# Altium schematic sheet ADC.SchDoc: EEG Measurement Circuit
size A2; Date: 24/01/2025; DrawnBy: Giang Phan Truong; SheetNumber: 5; SheetTotal: 7
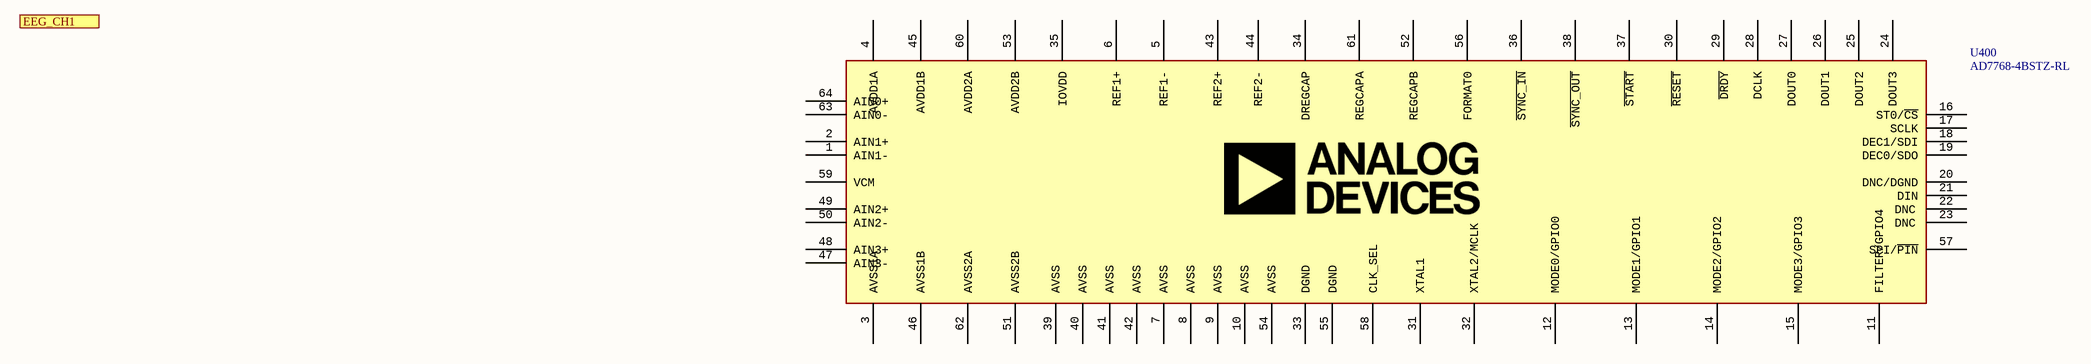
[diagram p0: ADC.SchDoc]

## Parts
U400  value AD7768-4BSTZ-RL  [ST-64-2_ADI]  (hidden comment: 24 Bit Analog to Digital Converter 4 Input 4 Sigma-Delta)

## Ports
EEG_CH1 (out, see Block Diagram[4B], EEG Preprocessing[8B])

## Nets

Not connected (* = marked no-connect by the designer): U400 1(AIN1-) 2(AIN1+) 3(AVSS1A) 4(AVDD1A) 5(REF1-) 6(REF1+) 7(AVSS) 8(AVSS) 9(AVSS) 10(AVSS) 11(FILTER/GPIO4) 12(MODE0/GPIO0) 13(MODE1/GPIO1) 14(MODE2/GPIO2) 15(MODE3/GPIO3) 16(ST0/~{CS}) 17(SCLK) 18(DEC1/SDI) 19(DEC0/SDO) 20(DNC/DGND) 21(DIN) 22(DNC) 23(DNC) 24(DOUT3) 25(DOUT2) 26(DOUT1) 27(DOUT0) 28(DCLK) 29(~{DRDY}) 30(~{RESET}) 31(XTAL1) 32(XTAL2/MCLK) 33(DGND) 34(DREGCAP) 35(IOVDD) 36(~{SYNC_IN}) 37(~{START}) 38(~{SYNC_OUT}) 39(AVSS) 40(AVSS) 41(AVSS) 42(AVSS) 43(REF2+) 44(REF2-) 45(AVDD1B) 46(AVSS1B) 47(AIN3-) 48(AIN3+) 49(AIN2+) 50(AIN2-) 51(AVSS2B) 52(REGCAPB) 53(AVDD2B) 54(AVSS) 55(DGND) 56(FORMAT0) 57(SPI/~{PIN}) 58(CLK_SEL) 59(VCM) 60(AVDD2A) 61(REGCAPA) 62(AVSS2A) 63(AIN0-) 64(AIN0+)

## Notes on the sheet
- Project Name:
- Date:
- Size
- Size:
- A2
- Last Modified:
- Revision:
- Drawn By:
- File:
- Checked By:
- Sheet
- of

## Library data of the parts
U400 = AD7768-4BSTZ-RL: 24 Bit Analog to Digital Converter 4 Input 4 Sigma-Delta 64-LQFP (10x10); Mfr_Name: Analog Devices Inc; Type: Data Acquisition; RefDes: RefDes; ComponentLink1Description: Buy; ComponentLink1URL: https://www.digikey.com/en/products/detail/analog-devices-inc/AD7768-4BSTZ-RL/6056981